# Altium project Driver Morpheus PONTE H.PrjPcb
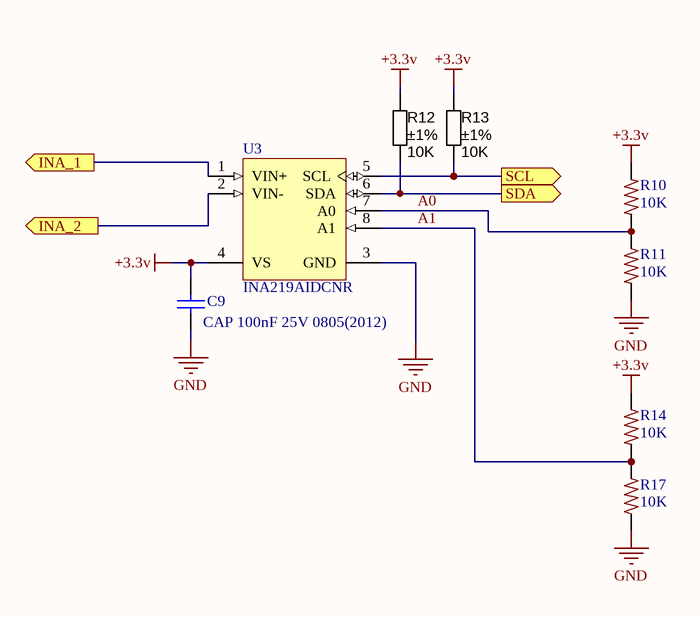
[diagram p0: Driver Morpheus SENSOR CORRENTE.SchDoc]
1 sheet, 8 parts. Net scope: flat (ports and power ports of the same name join across sheets).
Board file: Driver Morpheus PONTE H.PcbDoc

## Sheet Driver Morpheus SENSOR CORRENTE.SchDoc
size A4

### Parts
C9  CAP 100nF 25V 0805(2012)  [CAPC0805(2012)145_M]
R10  10K  [0402-RES-HD]
R11  10K  [0402-RES-HD]
R12  value 10K  Tolerance: ±1%  [RESC1608X55N]  (hidden comment: Thick Film)
R13  value 10K  Tolerance: ±1%  [RESC1608X55N]  (hidden comment: Thick Film)
R14  10K  [0402-RES-HD]
R17  10K  [0402-RES-HD]
U3  INA219AIDCNR  [DCN0008A_M]

### Ports
INA_1 (out), INA_2 (out), SCL (out), SDA (out)

### Nets
+3.3v: C9.2 R10.2 R12.1 R13.1 R14.2 U3.4(VS)
GND: C9.1 R11.1 R17.1 U3.3(GND)
A0: R10.1 R11.2 U3.7(A0)
A1: R14.1 R17.2 U3.8(A1)
NetR12_2: R12.2 U3.6(SDA) ; port SDA
NetR13_2: R13.2 U3.5(SCL) ; port SCL
NetU3_1: U3.1(VIN+) ; port INA_1
NetU3_2: U3.2(VIN-) ; port INA_2

### Library data of the parts
C9 = CMP-1036-04408-1: CAP 100nF 25V ±5% 0805 (2012 Metric) Thickness 1.45mm SMD; Case-Metric: 2012; Case-EIA: 0805; Tolerance: Â±5%; Value: 100nF; Rated Voltage: 25 V; Max Thickness: 1.45 mm; Technology: SMT
R10 R11 R14 R17 = R0402-10K-11: RES 10K OHM 1/10W 1% 0402 SMD; Part No: ERJ-2RKF1002X; Cod EMS: 05.280.029.525; Family Description: RESISTOR FILME ESPESSO 10R-1M / 1/10W / 1% / 0402. P/N: ERJ-2RKF....X – PANASONIC ELECTRONIC COMPONENTS.; Value: 10K; Family: ERJ-2RKF....X
R12 R13 = RES_10K_0603_1%: Resistor SMD chip 10k Ohm 0.1W 1% 0603; Manufacturer 1: Yageo; Manufacturer Part Number 1: RC0603FR-0710KL; Ratings: 1/10W; SCDType: spec; Package / Case: 0603 (1608 Metric); Supplier 1: Digi-Key; Supplier Part Number 1: 311-10.0KHRCT-ND
U3 = CMP-0704-00041-2: Zero-Drift, Bi-directional Current / Power Monitor, 3 to 5.5 V, -40 to 125 degC, 8-pin SOP (DCN8), Green (RoHS & no Sb/Br); Manufacturer: Texas Instruments; Input Offset (+/-)(Max)(uV): 100; Small-Signal Bandwidth(Typ)(MHz): 0.011; SubFamily: Current Shunt Monitor; Rating: Catalog; Quiescent Current (+/-)(Typ)(mA): 0.7; Vs(Max)(V): 5.5; Common Mode Range(Min)(V): 0; Vs(Min)(V): 3; Common Mode Range(Max)(V): 26; Gain(V/V): 1, 0.5, 0.25, 0.125; ComponentLink3URL: http://www.ti.com/lit/ml/mpds099c/mpds099c.pdf; ComponentLink2URL: http://www.ti.com/general/docs/lit/getliterature.tsp?genericPartNumber=INA219&fileType=pdf; PackageReference: DCN0008A; ComponentLink1URL: http://www.ti.com/; ComponentLink1Description: Manufacturer URL; Code_JEDEC: MO-178; CMRR(Min)(dB): 100; DatasheetVersion: SBOS448F; Mounting Technology: Surface Mount; ComponentLink3Description: Package Specification; PartNumber: INA219AIDCNR; PackageVersion: 4202106/D, 11/2009; Eco-Plan: Green (RoHS & no Sb/Br); ComponentLink2Description: Datasheet; PackageDescription: 8-Pin Plastic Small Outline, Body 1.6 x 2.9 mm, Pitch 0.65 mm